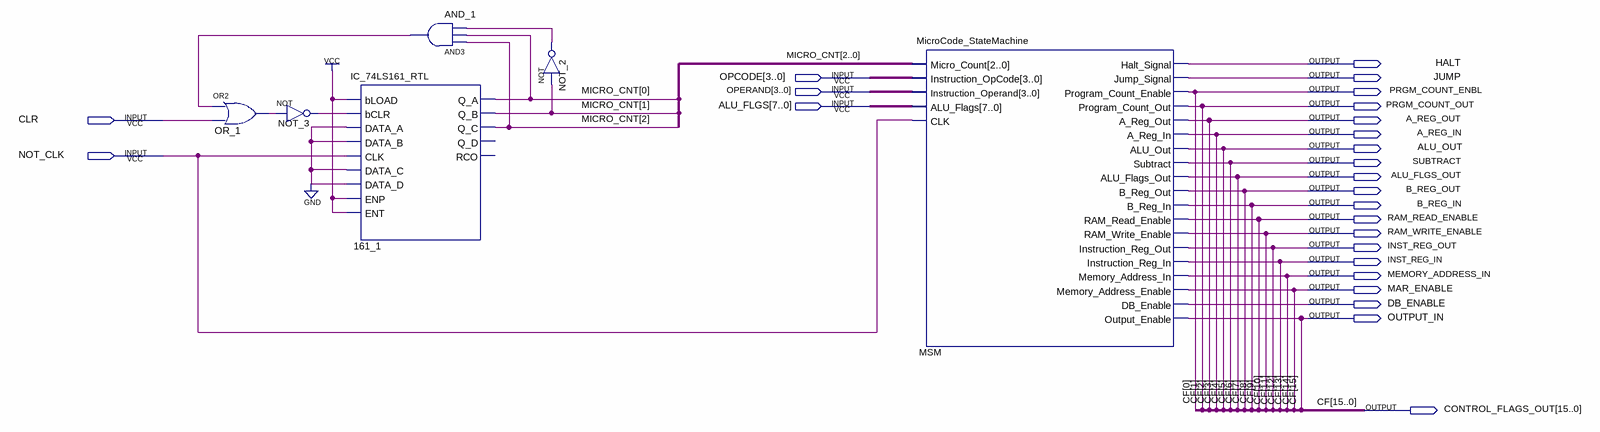
[diagram p0: schematic sheet]
// Quartus schematic Control_Logic.bdf as structural Verilog: 6 symbols, 25 pins
module Control_Logic (
  input  [3:0] OPCODE,
  input  [3:0] OPERAND,
  input  [7:0] ALU_FLGS,
  input  CLR,
  input  NOT_CLK,
  output HALT,
  output JUMP,
  output PRGM_COUNT_ENBL,
  output PRGM_COUNT_OUT,
  output A_REG_OUT,
  output A_REG_IN,
  output ALU_OUT,
  output SUBTRACT,
  output ALU_FLGS_OUT,
  output B_REG_OUT,
  output B_REG_IN,
  output RAM_READ_ENABLE,
  output RAM_WRITE_ENABLE,
  output INST_REG_OUT,
  output INST_REG_IN,
  output MEMORY_ADDRESS_IN,
  output MAR_ENABLE,
  output DB_ENABLE,
  output OUTPUT_IN,
  output [15:0] CONTROL_FLAGS_OUT
);

  wire AND_1_out, NOT_2_out, NOT_3_out, OR_1_out;
  wire [2:0] MICRO_CNT;

  or OR_1 (OR_1_out, AND_1_out, CLR);
  not NOT_3 (NOT_3_out, OR_1_out);
  IC_74LS161_RTL u_161_1 (
    .bLOAD(1'b1), .bCLR(NOT_3_out), .DATA_A(1'b0), .DATA_B(1'b0), .CLK(NOT_CLK), .DATA_C(1'b0),
    .DATA_D(1'b0), .ENP(1'b1), .ENT(1'b1), .Q_A(MICRO_CNT[0]), .Q_B(MICRO_CNT[1]), .Q_C(MICRO_CNT[2]));  // open: Q_D, RCO
  and AND_1 (AND_1_out, MICRO_CNT[2], MICRO_CNT[0], NOT_2_out);
  not NOT_2 (NOT_2_out, MICRO_CNT[1]);
  MicroCode_StateMachine MSM (
    .Micro_Count(MICRO_CNT), .Instruction_OpCode(OPCODE), .Instruction_Operand(OPERAND),
    .ALU_Flags(ALU_FLGS), .CLK(NOT_CLK), .Halt_Signal(HALT), .Jump_Signal(JUMP),
    .Program_Count_Enable(CONTROL_FLAGS_OUT[0]), .Program_Count_Out(CONTROL_FLAGS_OUT[1]),
    .A_Reg_Out(A_REG_OUT), .A_Reg_In(A_REG_IN), .ALU_Out(ALU_OUT), .Subtract(CONTROL_FLAGS_OUT[5]),
    .ALU_Flags_Out(ALU_FLGS_OUT), .B_Reg_Out(B_REG_OUT), .B_Reg_In(B_REG_IN),
    .RAM_Read_Enable(CONTROL_FLAGS_OUT[9]), .RAM_Write_Enable(CONTROL_FLAGS_OUT[10]),
    .Instruction_Reg_Out(CONTROL_FLAGS_OUT[11]), .Instruction_Reg_In(CONTROL_FLAGS_OUT[12]),
    .Memory_Address_In(CONTROL_FLAGS_OUT[13]), .Memory_Address_Enable(CONTROL_FLAGS_OUT[14]),
    .DB_Enable(DB_ENABLE), .Output_Enable(CONTROL_FLAGS_OUT[15]));

  assign {CONTROL_FLAGS_OUT[8:6], CONTROL_FLAGS_OUT[4:2]} = {B_REG_IN, B_REG_OUT, ALU_FLGS_OUT, ALU_OUT, A_REG_IN, A_REG_OUT};
  assign INST_REG_IN = CONTROL_FLAGS_OUT[12];
  assign INST_REG_OUT = CONTROL_FLAGS_OUT[11];
  assign MAR_ENABLE = CONTROL_FLAGS_OUT[14];
  assign MEMORY_ADDRESS_IN = CONTROL_FLAGS_OUT[13];
  assign OUTPUT_IN = CONTROL_FLAGS_OUT[15];
  assign PRGM_COUNT_ENBL = CONTROL_FLAGS_OUT[0];
  assign PRGM_COUNT_OUT = CONTROL_FLAGS_OUT[1];
  assign RAM_READ_ENABLE = CONTROL_FLAGS_OUT[9];
  assign RAM_WRITE_ENABLE = CONTROL_FLAGS_OUT[10];
  assign SUBTRACT = CONTROL_FLAGS_OUT[5];

  // Other names for the same wires on the sheet: CF[15:0] = {CONTROL_FLAGS_OUT[15:9], B_REG_IN, B_REG_OUT, ALU_FLGS_OUT, CONTROL_FLAGS_OUT[5], ALU_OUT, A_REG_IN, A_REG_OUT, CONTROL_FLAGS_OUT[1:0]}
endmodule
